# Altium schematic sheet Schematic.schdoc
size 168 x 116 mm
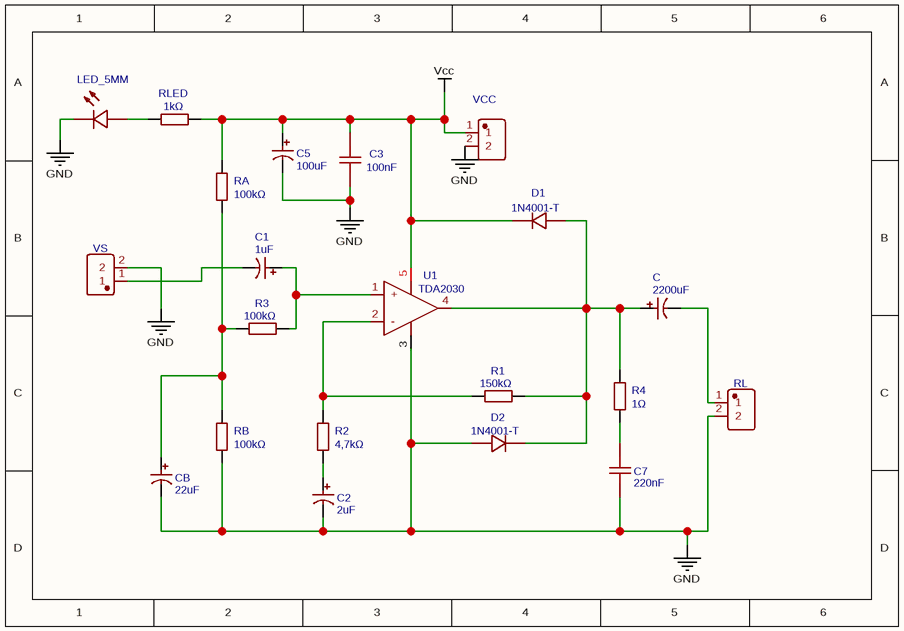
[diagram p0: Schematic.schdoc]

## Parts
C  2200uF  [CAP-TH_BD10.0-P5.00-D1.0-FD]
C1  1uF  [CAP-TH_BD6.3-P2.50-D1.0-FD]
C2  2uF  [CAP-TH_BD6.3-P2.50-D1.0-FD]
C3  100nF  [CAP-TH_L4.9-W3.7-P5.08-D0.5]
C5  100uF  [CAP-TH_BD6.3-P2.50-D1.0-FD]
C7  220nF  [CAP-TH_L4.9-W3.7-P5.08-D0.5]
CB  22uF  [CAP-TH_BD6.3-P2.50-D1.0-FD]
D1  1N4001-T  [DO-41_BD2.4-L4.7-P8.70-D0.9-RD]
D2  1N4001-T  [DO-41_BD2.4-L4.7-P8.70-D0.9-RD]
LED_5MM  SLH-56VC3FT  [LED-TH_BD5.0-P2.54-FD]  (value not drawn)
R1  150kΩ  [RES-TH_BD2.2-L6.5-P10.50-D0.6]
R2  4,7kΩ  [RES-TH_BD2.2-L6.5-P10.50-D0.6]
R3  100kΩ  [RES-TH_BD2.2-L6.5-P10.50-D0.6]
R4  1Ω  [RES-TH_BD2.2-L6.5-P10.50-D0.6]
RA  100kΩ  [RES-TH_BD2.2-L6.5-P10.50-D0.6]
RB  100kΩ  [RES-TH_BD2.2-L6.5-P10.50-D0.6]
RL  744-81-02TW0A  [CONN-TH_2P-P2.54-V-M_744-81-02TXXX]  (value not drawn)
RLED  1kΩ  [RES-TH_BD2.2-L6.5-P10.50-D0.6]
U1  TDA2030  [TO-220-5_L10.5-W15.5-P1.70-TL]
VCC  744-81-02TW0A  [CONN-TH_2P-P2.54-V-M_744-81-02TXXX]  (value not drawn)
VS  744-81-02TW0A  [CONN-TH_2P-P2.54-V-M_744-81-02TXXX]  (value not drawn)

## Nets
GND: C2.2 C3.1 C5.2 C7.1 CB.2 D2.2(A) LED_5MM.2 R1.1 R2.2 RB.1 RL.2 U1.2(-) U1.3(GND) VCC.2 VS.2
Vcc: C3.2 C5.1 D1.1(C) RA.2 RLED.2 U1.5(VCC+) VCC.1
NetC1_1: C1.1 R3.2 U1.1(+)
NetC1_2: C1.2 CB.1 R3.1 RA.1 RB.2 VS.1
NetC2_1: C2.1 R2.1
NetC7_2: C7.2 R4.1
NetC_1: C.1 D1.2(A) D2.1(C) R1.2 R4.2 U1.4(OUT)
NetC_2: C.2 RL.1
NetLED_5MM_1: LED_5MM.1 RLED.1

## Library data of the parts
C = 2200uF: Manufacturer: CX(承兴); Manufacturer Part: KM228M016G20RR0VH2FP0; nameAlias: Value; Supplier: LCSC; Supplier Part: C3328; JLCPCB Part Class: Extended Part; spicePre: C; spiceSymbolName: 16V2200uf 10X20
C1 = 1uF: Manufacturer: CX(承兴); Manufacturer Part: KM106M100E11RR0VH2FP0; nameAlias: Value; Supplier: LCSC; Supplier Part: C2029; JLCPCB Part Class: Extended Part; spicePre: C; spiceSymbolName: 10uf/100V
C2 = 2uF: Manufacturer: CX(承兴); Manufacturer Part: KM106M100E11RR0VH2FP0; nameAlias: Value; Supplier: LCSC; Supplier Part: C2029; JLCPCB Part Class: Extended Part; spicePre: C; spiceSymbolName: 10uf/100V
C3 = 100nF: Manufacturer: TORCH(火炬); Manufacturer Part: CC4-0805-CG-100V-300pF-J; nameAlias: Value; Contributor: LCSC; Supplier: LCSC; Supplier Part: C454404; JLCPCB Part Class: Extended Part; spicePre: C; spiceSymbolName: CC4-0805-CG-100V-300PF-J
C5 = 100uF: Manufacturer: CX(承兴); Manufacturer Part: KM106M100E11RR0VH2FP0; nameAlias: Value; Supplier: LCSC; Supplier Part: C2029; JLCPCB Part Class: Extended Part; spicePre: C; spiceSymbolName: 10uf/100V
C7 = 220nF: Manufacturer: TORCH(火炬); Manufacturer Part: CC4-0805-CG-100V-300pF-J; nameAlias: Value; Contributor: LCSC; Supplier: LCSC; Supplier Part: C454404; JLCPCB Part Class: Extended Part; spicePre: C; spiceSymbolName: CC4-0805-CG-100V-300PF-J
CB = 22uF: Manufacturer: CX(承兴); Manufacturer Part: KM106M100E11RR0VH2FP0; nameAlias: Value; Supplier: LCSC; Supplier Part: C2029; JLCPCB Part Class: Extended Part; spicePre: C; spiceSymbolName: 10uf/100V
D1 D2 = 1N4001-T: Manufacturer: DIODES(美台); Contributor: LCSC; Supplier: LCSC; Supplier Part: C99656; Manufacturer Part: 1N4001-T; JLCPCB Part Class: Extended Part; spicePre: D; spiceSymbolName: 1N4001-T
LED_5MM = SLH-56VC3FT: Manufacturer: ROHM(罗姆); Contributor: LCSC; Supplier: LCSC; Supplier Part: C162069; Manufacturer Part: SLH-56VC3FT; JLCPCB Part Class: Extended Part; spicePre: L; spiceSymbolName: SLH-56VC3FT
R1 = 150kΩ: Manufacturer: CCO(千志电子); Manufacturer Part: MF1/4W-560Ω±1% T; nameAlias: Value; Supplier: LCSC; Supplier Part: C127222; JLCPCB Part Class: Extended Part; spicePre: R; spiceSymbolName: MF1/4W-560Ω±1%
R2 = 4,7kΩ: Manufacturer: CCO(千志电子); Manufacturer Part: MF1/4W-560Ω±1% T; nameAlias: Value; Supplier: LCSC; Supplier Part: C127222; JLCPCB Part Class: Extended Part; spicePre: R; spiceSymbolName: MF1/4W-560Ω±1%
R3 RA RB = 100kΩ: Manufacturer: CCO(千志电子); Manufacturer Part: MF1/4W-560Ω±1% T; nameAlias: Value; Supplier: LCSC; Supplier Part: C127222; JLCPCB Part Class: Extended Part; spicePre: R; spiceSymbolName: MF1/4W-560Ω±1%
R4 = 1Ω: Manufacturer: CCO(千志电子); Manufacturer Part: MF1/4W-560Ω±1% T; nameAlias: Value; Supplier: LCSC; Supplier Part: C127222; JLCPCB Part Class: Extended Part; spicePre: R; spiceSymbolName: MF1/4W-560Ω±1%
RL VCC VS = 744-81-02TW0A: Manufacturer: PINREX(频锐科技); Contributor: LCSC; Supplier: LCSC; Supplier Part: C402769; Manufacturer Part: 744-81-02TW0A; JLCPCB Part Class: Extended Part; spicePre: C; spiceSymbolName: 744-81-02TW0A
RLED = 1kΩ: Manufacturer: CCO(千志电子); Manufacturer Part: MF1/4W-560Ω±1% T; nameAlias: Value; Supplier: LCSC; Supplier Part: C127222; JLCPCB Part Class: Extended Part; spicePre: R; spiceSymbolName: MF1/4W-560Ω±1%
U1 = TDA2030: Manufacturer: UTC(友顺); Manufacturer Part: TDA2030AL-TB51-T; Supplier: LCSC; Supplier Part: C109230; JLCPCB Part Class: Extended Part; spicePre: U; spiceSymbolName: TDA2030AL-TB51-T